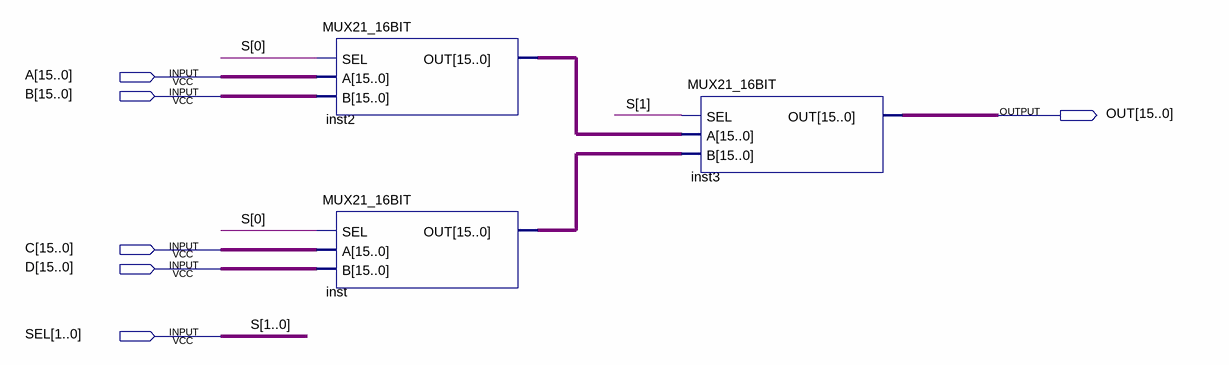
[diagram p0: schematic sheet]
// Quartus schematic MUX41_16BIT.bdf as structural Verilog: 3 symbols, 6 pins
module MUX41_16BIT (
  input  [15:0] A,
  input  [15:0] B,
  input  [15:0] C,
  input  [15:0] D,
  input  [1:0] SEL,
  output [15:0] OUT
);

  wire [15:0] inst2_out, inst_out;

  MUX21_16BIT inst2 (.SEL(SEL[0]), .A(A), .B(B), .OUT(inst2_out));
  MUX21_16BIT inst (.SEL(SEL[0]), .A(C), .B(D), .OUT(inst_out));
  MUX21_16BIT inst3 (.SEL(SEL[1]), .A(inst2_out), .B(inst_out), .OUT(OUT));

  // Other names for the same wires on the sheet: S[1:0] = SEL
endmodule
